# Altium schematic sheet EdgeMax_ExtraMemory.SchDoc
size A4; SheetNumber: 3; SheetTotal: 3
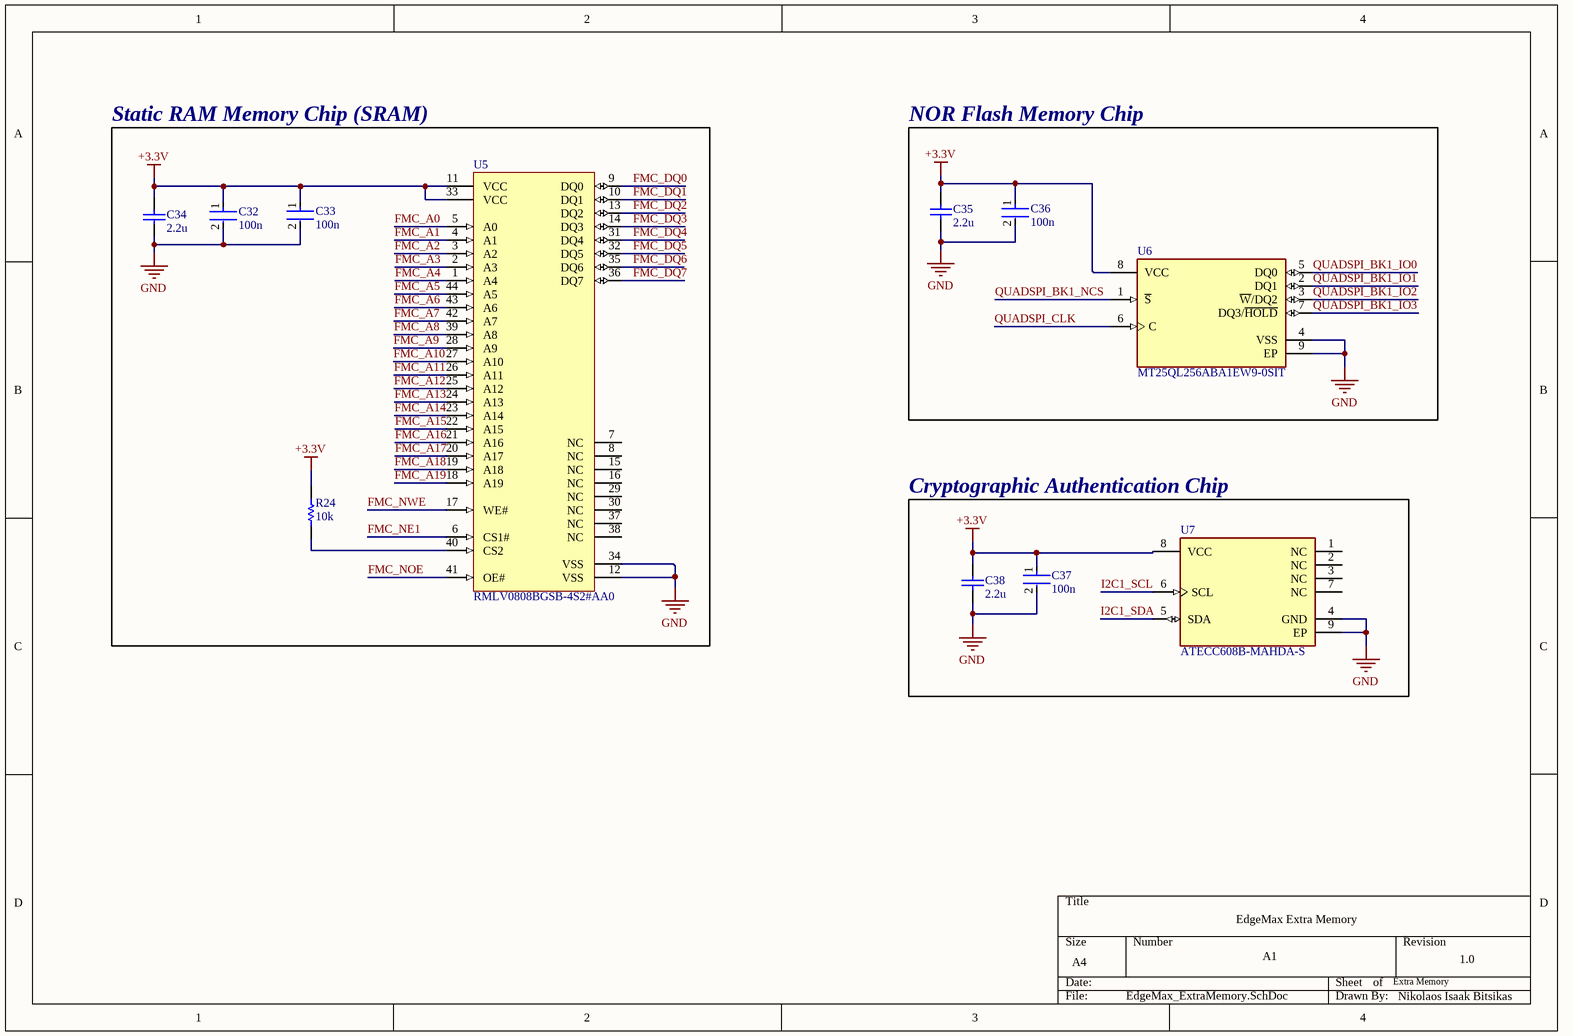
[diagram p0: EdgeMax_ExtraMemory.SchDoc]

## Parts
C32  100n  [FP-CL10-IPC_A]
C33  100n  [FP-CL10-IPC_A]
C34  2.2u  [CAPC2013X135X50ML10T20]
C35  2.2u  [CAPC2013X135X50ML10T20]
C36  100n  [FP-CL10-IPC_A]
C37  100n  [FP-CL10-IPC_A]
C38  2.2u  [CAPC2013X135X50ML10T20]
R24  10k  [RESC2013X60X35NL10T20]
U5  RMLV0808BGSB-4S2#AA0  [TSOP80P1180X120_HS-45_PTSB0044GG-A_N]
U6  MT25QL256ABA1EW9-0SIT  [FP-W9-IPC_C]
U7  ATECC608B-MAHDA-S  [FP-C04-21355-Q4B-IPC_B]

## Blocks framed on the sheet
Static RAM Memory Chip (SRAM): C32-C34 R24 U5
NOR Flash Memory Chip: C35 C36 U6
Cryptographic Authentication Chip: C37 C38 U7

## Nets
+3.3V: C32.1 C33.1 C34.2 C35.2 C36.1 C37.1 C38.2 R24.2 U5.11(VCC) U5.33(VCC) U6.8(VCC) U7.8(VCC)
GND: C32.2 C33.2 C34.1 C35.1 C36.2 C37.2 C38.1 U5.12(VSS) U5.34(VSS) U6.4(VSS) U6.9(EP) U7.4(GND) U7.9(EP)
FMC_A0: U5.5(A0)
FMC_A1: U5.4(A1)
FMC_A2: U5.3(A2)
FMC_A3: U5.2(A3)
FMC_A4: U5.1(A4)
FMC_A5: U5.44(A5)
FMC_A6: U5.43(A6)
FMC_A7: U5.42(A7)
FMC_A8: U5.39(A8)
FMC_A9: U5.28(A9)
FMC_A10: U5.27(A10)
FMC_A11: U5.26(A11)
FMC_A12: U5.25(A12)
FMC_A13: U5.24(A13)
FMC_A14: U5.23(A14)
FMC_A15: U5.22(A15)
FMC_A16: U5.21(A16)
FMC_A17: U5.20(A17)
FMC_A18: U5.19(A18)
FMC_A19: U5.18(A19)
FMC_DQ0: U5.9(DQ0)
FMC_DQ1: U5.10(DQ1)
FMC_DQ2: U5.13(DQ2)
FMC_DQ3: U5.14(DQ3)
FMC_DQ4: U5.31(DQ4)
FMC_DQ5: U5.32(DQ5)
FMC_DQ6: U5.35(DQ6)
FMC_DQ7: U5.36(DQ7)
FMC_NOE: U5.41(OE#)
FMC_NWE: U5.17(WE#)
FMC_ΝΕ1: U5.6(CS1#)
I2C1_SCL: U7.6(SCL)
I2C1_SDA: U7.5(SDA)
QUADSPI_BK1_IO0: U6.5(DQ0)
QUADSPI_BK1_IO1: U6.2(DQ1)
QUADSPI_BK1_IO2: U6.3(~{W}/DQ2)
QUADSPI_BK1_IO3: U6.7(DQ3/~{HOLD})
QUADSPI_BK1_NCS: U6.1(~{S})
QUADSPI_CLK: U6.6(C)
NetR24_1: R24.1 U5.40(CS2)

Not connected (* = marked no-connect by the designer): U5 7(NC) 8(NC) 15(NC) 16(NC) 29(NC) 30(NC) 37(NC) 38(NC); U7 1(NC) 2(NC) 3(NC) 7(NC)

## Notes on the sheet
- EdgeMax Extra Memory
- A1
- Extra Memory
- 1.0
- Nikolaos Isaak Bitsikas

## Library data of the parts
C32 C33 C36 C37 = CMP-13271-000587-1: Cap Ceramic 100nF 50V X7R ±10% Pad SMD 0603 +125°C T/R; Case/Package: 0603; Depth: 0.8mm; Max Operating Temperature: 125°C; Lead Free: Lead Free; Material: Ceramic; Voltage Rating: 50V; Min Operating Temperature: -55°C; Voltage Rating (DC): 50V; Dielectric: X7R; Height: 0.8mm; Capacitance: 100nF; Thickness: 0.035inch; Radiation Hardening: No; Voltage: 50V; Packaging: Tape and Reel; Length: 1.6mm; Tolerance: 10%; Width: 0.031inch; Mount: Surface Mount; Package Quantity: 10000
C34 C35 C38 = CMP-2007-03455-1: Manufacturer: Murata; Part Number: GRM21BR71C225KA12L
R24 = CMP-1659-00013-4: Chip Resistor, 10 KOhm, +/- 1%, 0.125 W, -55 to 155 degC, 0805 (2012 Metric), RoHS, Tape and Reel; Manufacturer: Yageo; Voltage Rating: 150 V; Mount: Surface Mount; ComponentLink1Description: Manufacturer URL; ComponentLink2URL: http://www.yageo.com/documents/recent/PYu-RC_Group_51_RoHS_L_04.pdf; Pins: 2; Length: 2 mm; Min Operating Temperature: -55 degC; Height: 0.5 mm; Mounting Technology: Surface Mount; RoHSCompliant: true; REACH SVHC: No SVHC; ComponentLink1URL: http://www.yageo.com/; Max Operating Temperature: 155 degC; PackageReference: 0805; DatasheetVersion: Rev. 4, 02/2016; Package Quantity: 5000; Packaging: Tape and Reel; ComponentLink2Description: Datasheet; PackageDescription: 2-Pin Surface Mounted Device, Body 2 x 1.25 mm
U5 = CMP-00572-60773492-1: SRAM Chip Async Single 3V 8M-Bit 1024K x 8 55ns 44-Pin TSOP-II Tray; Manufacturer Lifecycle Status: ACTIVE; Max Input Voltage: 3.6V; Min Input Voltage: 2.4V; Memory Size: 1MB; Interface: Parallel; Access Time: 45ns; Number of Pins: 44; RoHS: Compliant; Lifecycle Status: Production; China RoHS: Compliant; ComponentLink1Description: Manufacturer's Website; ComponentLink2Description: Datasheet URL; Height: 1.2mm; ComponentLink2URL: https://octopart.com/cad-content/api/get-model-datasheet/15189/60773492; Min Operating Temperature: -40°C; ComponentLink3URL: https://www.renesas.com/en/document/psc/package-drawing-tsop2-44pin-ptsb0044gg; ComponentLink3Description: Manufacturer's Package Drawing; Case/Package: TSOP; Max Operating Temperature: 85°C; HelpURL: https://octopart.com/cad-content/api/get-model-datasheet/15189/60773492; Memory Type: SRAM; Width: 10mm; Min Supply Voltage: 2.4V; Length: 18.41mm; Mount: Surface Mount; Ambient Temperature Range High: 85°C; Max Supply Voltage: 3.6V; ComponentLink1URL: http://www.renesas.com
U6 = CMP-2000-07471-2: IC FLASH 256M SPI 133MHZ 8WPDFN; Manufacturer: Micron; Memory Size: 256Mbits; Min Supply Voltage: 2.7V; Max Supply Voltage: 3.6V; Memory Type: FLASH,NOR; Nominal Supply Current: 10-35mA; Access Time: 7ns; Standoff Height: 0mm; RoHS: TRUE; Ambient Temperature Range Low: -40°C; Height: 0.8mm; Package: W9; ComponentLink2Description: Datasheet; Ipc Land Pattern Name: DFN600X800X75-8; Temperature: -40°C to +85°C; Manufacturer Part Number: MT25QL256ABA1EW9-0SIT; Digikey Description: IC FLASH 256M SPI 133MHZ 8WPDFN; Mouser Description: NOR Flash Serial-SPI 3V/3.3V 256M-bit 32M x 8 8-Pin WPDFN; ComponentLink2URL: https://www.micron.com/~/media/documents/products/data-sheet/nor-flash/serial-nor/mt25q/die-rev-a/mt25q_qljs_l_256_aba_0.pdf; Temperature Range Low: -40°C; Interface: SPI; Frequency: 133MHz; Device Class L1: Integrated Circuits (ICs); Device Class L2: Memory; Temperature Range High: +85°C; Automotive: No; Octopart: https://octopart.com/mt25ql256aba1ew9-0sit-micron-48615906; Lead Free: Yes; Device Class L3: Flash; Category: IC; Ambient Temperature Range High: +85°C
U7 = CMP-06260-000008-1: IC AUTHENTICATION CHIP